# EAGLE schematic example (EAGLE 6.5.0)
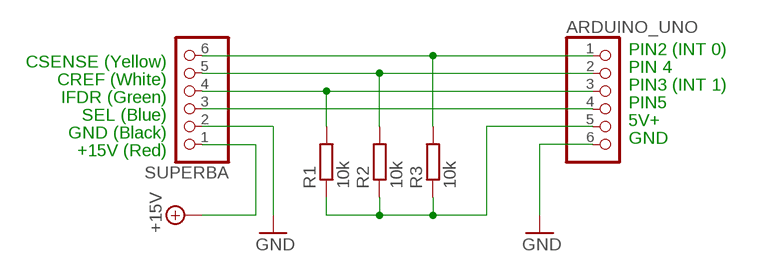
[diagram p0: schematic, sheet 1]

## Parts
ARDUINO_UNO  PINHD-1X6  [1X06]
R1  10k  R-EU_0309/12  [0309/12]
R2  10k  R-EU_0309/12  [0309/12]
R3  10k  R-EU_0309/12  [0309/12]
SUPERBA  PINHD-1X6  [1X06]

## Nets
+15V: SUPERBA.1
GND: ARDUINO_UNO.6 SUPERBA.2
N$1: ARDUINO_UNO.1 R3.2 SUPERBA.6
N$2: ARDUINO_UNO.2 R2.2 SUPERBA.5
N$3: ARDUINO_UNO.3 R1.2 SUPERBA.4
N$4: ARDUINO_UNO.4 SUPERBA.3
N$7: ARDUINO_UNO.5 R1.1 R2.1 R3.1

## Notes on the sheet
- CSENSE (Yellow) | PIN2 (INT 0)
- CREF (White) | PIN 4
- IFDR (Green) | PIN3 (INT 1)
- SEL (Blue) | PIN5
- GND (Black) | 5V+
- +15V (Red) | GND

## Library data of the parts
ARDUINO_UNO SUPERBA = pinhead:PINHD-1X6: PIN HEADER
R1-R3 = resistor:R-EU_: RESISTOR, European symbol